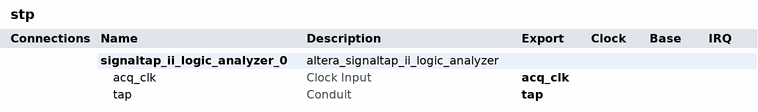
[diagram p0: system contents]
# Platform Designer (Qsys) system stp, Cyclone IV E EP4CE10E22A7
# Parameters at their usual value, and those the tool derives, are not listed.
package require -exact qsys 16.0
create_system stp
set_project_property DEVICE_FAMILY {Cyclone IV E}
set_project_property DEVICE EP4CE10E22A7

add_instance signaltap_ii_logic_analyzer_0 altera_signaltap_ii_logic_analyzer 16.0
set_instance_property signaltap_ii_logic_analyzer_0 AUTO_EXPORT true
set_instance_parameter_value signaltap_ii_logic_analyzer_0 device_family {Cyclone IV E}
set_instance_parameter_value signaltap_ii_logic_analyzer_0 gui_num_segments 2
set_instance_parameter_value signaltap_ii_logic_analyzer_0 gui_ram_type AUTO
set_instance_parameter_value signaltap_ii_logic_analyzer_0 gui_sq Continuous
set_instance_parameter_value signaltap_ii_logic_analyzer_0 gui_trigger_out_enabled false
set_instance_parameter_value signaltap_ii_logic_analyzer_0 gui_use_segmented false
set_instance_parameter_value signaltap_ii_logic_analyzer_0 sld_counter_pipeline 0
set_instance_parameter_value signaltap_ii_logic_analyzer_0 sld_data_bits 128
set_instance_parameter_value signaltap_ii_logic_analyzer_0 sld_enable_advanced_trigger 0
set_instance_parameter_value signaltap_ii_logic_analyzer_0 sld_node_crc_bits 32
set_instance_parameter_value signaltap_ii_logic_analyzer_0 sld_node_info 806383104
set_instance_parameter_value signaltap_ii_logic_analyzer_0 sld_pipeline_factor 0
set_instance_parameter_value signaltap_ii_logic_analyzer_0 sld_ram_pipeline 0
set_instance_parameter_value signaltap_ii_logic_analyzer_0 sld_sample_depth 128
set_instance_parameter_value signaltap_ii_logic_analyzer_0 sld_storage_qualifier_gap_record 0
set_instance_parameter_value signaltap_ii_logic_analyzer_0 sld_trigger_bits 1
set_instance_parameter_value signaltap_ii_logic_analyzer_0 sld_trigger_in_enabled 0
set_instance_parameter_value signaltap_ii_logic_analyzer_0 sld_trigger_level 1
set_instance_parameter_value signaltap_ii_logic_analyzer_0 sld_trigger_level_pipeline 1
set_instance_parameter_value signaltap_ii_logic_analyzer_0 sld_trigger_pipeline 0

# exported interfaces
add_interface acq_clk clock sink
set_interface_property acq_clk EXPORT_OF signaltap_ii_logic_analyzer_0.acq_clk
add_interface tap conduit end
set_interface_property tap EXPORT_OF signaltap_ii_logic_analyzer_0.tap

set_interconnect_requirement {$system} qsys_mm.clockCrossingAdapter HANDSHAKE
set_interconnect_requirement {$system} qsys_mm.enableEccProtection FALSE
set_interconnect_requirement {$system} qsys_mm.insertDefaultSlave FALSE
set_interconnect_requirement {$system} qsys_mm.maxAdditionalLatency 1

save_system stp.qsys
